# EAGLE schematic RFM69PI (EAGLE 6.4)
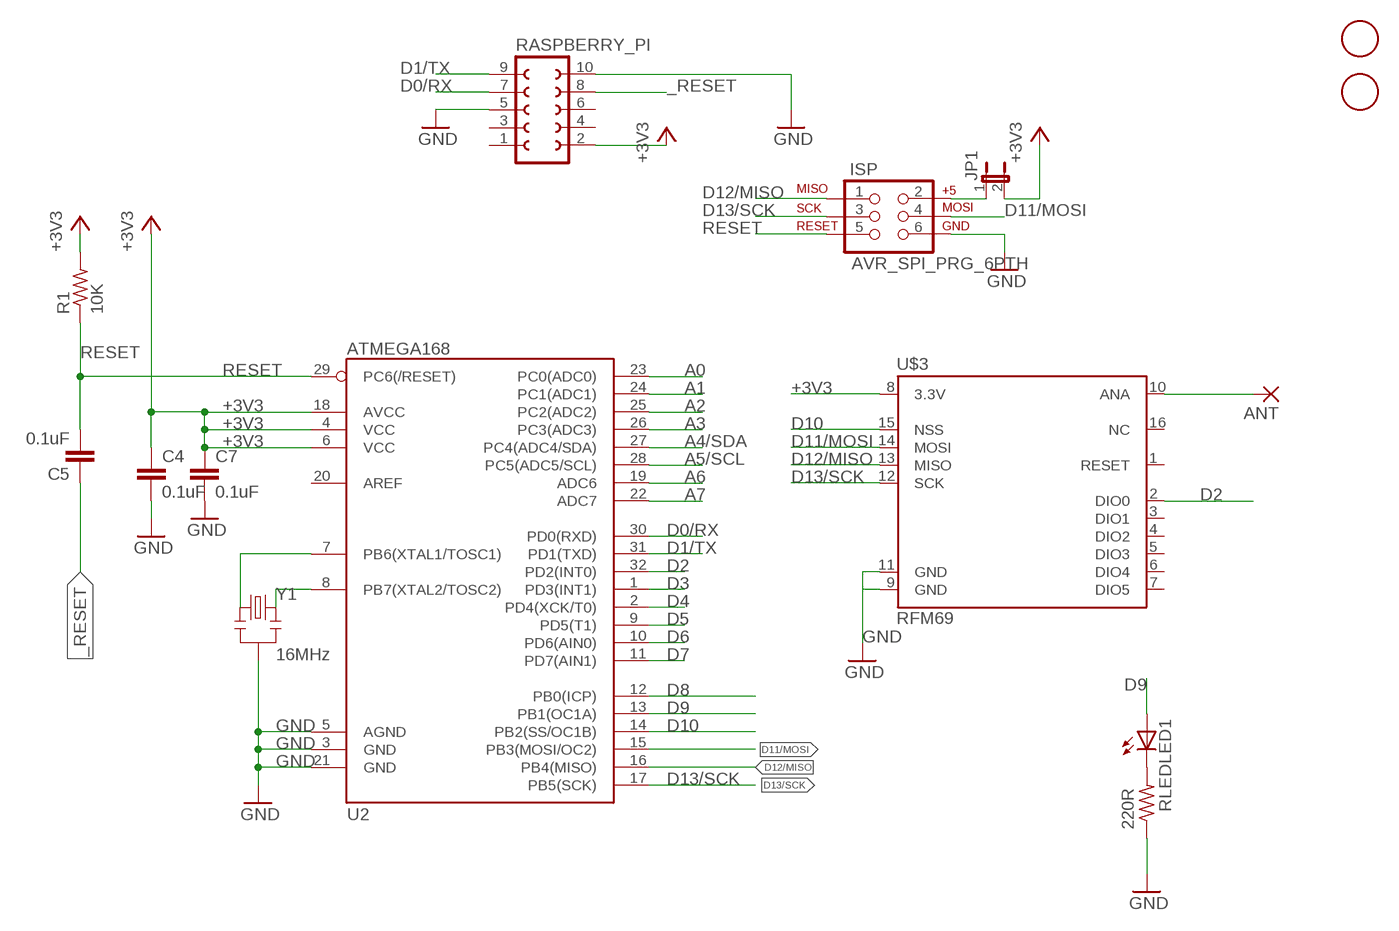
[diagram p0: schematic, sheet 1]

## Parts
ANT  1,6/0,8  [1,6/0,8]
C4  0.1uF  C-EUC0805  [C0805]
C5  0.1uF  C-EUC0805  [C0805]
C7  0.1uF  C-EUC0805  [C0805]
ISP  AVR_SPI_PRG_6PTH  [2X3]
JP1  JUMPER-2PTH  [1X02]
LED1  LEDSML0805  [SML0805]
R1  10K  R-US_R0805  [R0805]
RASPBERRY_PI  FE05-2  [FE05-2]
RLED  220R  R-US_R0805  [R0805]
U2  ATMEGA168  [TQFP32-08]
U$1  FIDUCIAL  [FIDUCIAL_1MM]
U$2  FIDUCIAL  [FIDUCIAL_1MM]
U$3  RFM69  [RFM69SMD]
Y1  16MHz  RESONATOR16MHZ  [RESONATOR-SMD]

## Nets
+3V3 [power]: C4.1 C7.1 JP1.2 R1.2 RASPBERRY_PI.2 U2.4(VCC) U2.6(VCC) U2.18(AVCC) U$3.8(3.3V)
+5V: ISP.2 JP1.1
_RESET: C5.1 RASPBERRY_PI.8
A0: U2.23(PC0(ADC0))
A1: U2.24(PC1(ADC1))
A2: U2.25(PC2(ADC2))
A3: U2.26(PC3(ADC3))
A4/SDA: U2.27(PC4(ADC4/SDA))
A5/SCL: U2.28(PC5(ADC5/SCL))
A6: U2.19(ADC6)
A7: U2.22(ADC7)
ANT [power]: ANT.1(P) U$3.10(ANA)
D0/RX: RASPBERRY_PI.7 U2.30(PD0(RXD))
D1/TX: RASPBERRY_PI.9 U2.31(PD1(TXD))
D2: U2.32(PD2(INT0)) U$3.2(DIO0)
D3: U2.1(PD3(INT1))
D4: U2.2(PD4(XCK/T0))
D5: U2.9(PD5(T1))
D6: U2.10(PD6(AIN0))
D7: U2.11(PD7(AIN1))
D8: U2.12(PB0(ICP))
D9: LED1.A U2.13(PB1(OC1A))
D10: U2.14(PB2(SS/OC1B)) U$3.15(NSS)
D11/MOSI: ISP.4 U2.15(PB3(MOSI/OC2)) U$3.14(MOSI)
D12/MISO: ISP.1 U2.16(PB4(MISO)) U$3.13(MISO)
D13/SCK: ISP.3 U2.17(PB5(SCK)) U$3.12(SCK)
GND [power]: C4.2 C7.2 ISP.6 RASPBERRY_PI.5 RASPBERRY_PI.10 RLED.1 U2.3(GND) U2.5(AGND) U2.21(GND) U$3.9(GND) U$3.11(GND) Y1.2
N$1: U2.7(PB6(XTAL1/TOSC1)) Y1.1
N$2: U2.8(PB7(XTAL2/TOSC2)) Y1.3
N$3: LED1.C RLED.2
RESET: C5.2 ISP.5 R1.1 U2.29(PC6(/RESET))
Unconnected: RASPBERRY_PI.1 RASPBERRY_PI.3 RASPBERRY_PI.4 RASPBERRY_PI.6 U2.20(AREF) U$3.1(RESET) U$3.3(DIO1) U$3.4(DIO2) U$3.5(DIO3) U$3.6(DIO4) U$3.7(DIO5)

## Power pins joined to a net without a drawn wire
NC: U$3.16(NC)

## Library data of the parts
ANT = JeeLabs:1,6/0,8: THROUGH-HOLE PAD
C4 C5 = rcl:C-EU: CAPACITOR, European symbol
C7 = resistor:C-EU: CAPACITOR, European symbol
ISP = SparkFun:AVR_SPI_PRG_6: AVR ISP 6 Pin This is the reduced ISP connector for AVR programming. Common on Arduino. This footprint will take up less PCB space and can be used with a 10-pin to 6-pin adapter such as SKU: BOB-08508
JP1 = SparkFun:JUMPER-2: Jumper Basic 0.1" spaced jumper. Use with breakaway headers.
LED1 = led:LED: LED OSRAM: - CHIPLED LG R971, LG N971, LY N971, LG Q971, LY Q971, LO R971, LY R971 LH N974, LH R974 LS Q976, LO Q976, LY Q976 LO Q996 - Hyper CHIPLED LW Q18S LB Q993, LB Q99A, LB R99A - SideLED LS A670, LO A670, LY A670, LG A670, LP A670 LB A673, LV A673, LT A673, LW A673 LH A674 LY A675 LS A676, LA A676, LO A676, LY A676, LW A676 LS A679, LY A679, LG A679 - Hyper Micro SIDELED® LS Y876, LA Y876, LO Y876, LY Y876 LT Y87S - SmartLED LW L88C, LW L88S LB L89C, LB L89S, LG L890 LS L89K, LO L89K, LY L89K LS L896, LA L896, LO L896, LY L896 - TOPLED LS T670, LO T670, LY T670, LG T670, LP T670 LSG T670, LSP T670, LSY T670, LOP T670, LYG T670 LG T671, LOG T671, LSG T671 LB T673, LV T673, LT T673, LW T673 LH T674 LS T676, LA T676, LO T676, LY T676, LB T676, LH T676, LSB T676, LW T676 LB T67C, LV T67C, LT T67C, LS T67K, LO T67K, LY T67K, LW E67C LS E67B, LA E67B, LO E67B, LY E67B, LB E67C, LV E67C, LT E67C LW T67C LS T679, LY T679, LG T679 LS T770, LO T770, LY T770, LG T770, LP T770 LB T773, LV T773, LT T773, LW T773 LH T774 LS E675, LA E675, LY E675, LS T675 LS T776, LA T776, LO T776, LY T776, LB T776 LHGB T686 LT T68C, LB T68C - Hyper Mini TOPLED® LB M676 - Mini TOPLED Santana® LG M470 LS M47K, LO M47K, LY M47K Source: http://www.osram.convergy.de LUXEON: - LUMILED® LXK2-PW12-R00, LXK2-PW12-S00, LXK2-PW14-U00, LXK2-PW14-V00 LXK2-PM12-R00, LXK2-PM12-S00, LXK2-PM14-U00 LXK2-PE12-Q00, LXK2-PE12-R00, LXK2-PE12-S00, LXK2-PE14-T00, LXK2-PE14-U00 LXK2-PB12-K00, LXK2-PB12-L00, LXK2-PB12-M00, LXK2-PB14-N00, LXK2-PB14-P00, LXK2-PB14-Q00 LXK2-PR12-L00, LXK2-PR12-M00, LXK2-PR14-Q00, LXK2-PR14-R00 LXK2-PD12-Q00, LXK2-PD12-R00, LXK2-PD12-S00 LXK2-PH12-R00, LXK2-PH12-S00 LXK2-PL12-P00, LXK2-PL12-Q00, LXK2-PL12-R00 Source: www.luxeon.com KINGBRIGHT: KA-3528ASYC Source: www.kingbright.com
R1 RLED = adafruit:R-US_: RESISTOR, American symbol
RASPBERRY_PI = con-lsta:FE05-2: FEMALE HEADER; OC_FARNELL: unknown; OC_NEWARK: unknown
U2 = SparkFun:ATMEGA168
U$1 U$2 = adafruit:FIDUCIAL: For use by pick and place machines to calibrate the vision/machine, 1mm By microbuilder.eu
U$3 = SWP:RFM69
Y1 = SparkFun-FreqCtrl:RESONATOR: Resonator Small SMD resonator. Used, eg, on the Arduino Pro/ Pro Mini boards. 8MHz- XTAL-08895 16MHz- XTAL-08900; PROD_ID: XTAL-08900

## Net classes
0 default: width 0.254 mm, drill 0.254 mm, clearance 0.254 mm
1 power: width 0.305 mm, drill 0.305 mm, clearance 0.305 mm